# Altium schematic sheet H01R0_Frontend 2.SchDoc
size Letter; CompanyName: Hexabitz; DocumentNumber: 3; SheetNumber: 3; SheetTotal: 3
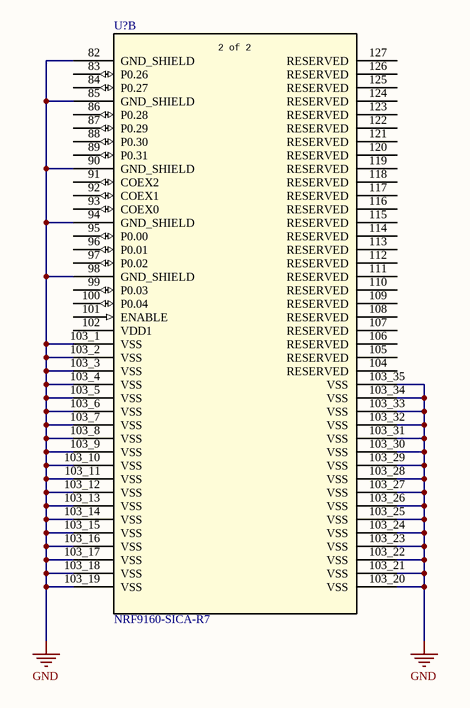
[diagram p0: H01R0_Frontend 2.SchDoc]

## Parts
U?  NRF9160-SICA-R7  [LGA127_16p00X10p50_nRF9160_NOR]  (part B of 2)

## Nets
GND: U?.82(GND_SHIELD) U?.85(GND_SHIELD) U?.90(GND_SHIELD) U?.94(GND_SHIELD) U?.98(GND_SHIELD) U?.103_1(VSS) U?.103_2(VSS) U?.103_3(VSS) U?.103_4(VSS) U?.103_5(VSS) U?.103_6(VSS) U?.103_7(VSS) U?.103_8(VSS) U?.103_9(VSS) U?.103_10(VSS) U?.103_11(VSS) U?.103_12(VSS) U?.103_13(VSS) U?.103_14(VSS) U?.103_15(VSS) U?.103_16(VSS) U?.103_17(VSS) U?.103_18(VSS) U?.103_19(VSS) U?.103_20(VSS) U?.103_21(VSS) U?.103_22(VSS) U?.103_23(VSS) U?.103_24(VSS) U?.103_25(VSS) U?.103_26(VSS) U?.103_27(VSS) U?.103_28(VSS) U?.103_29(VSS) U?.103_30(VSS) U?.103_31(VSS) U?.103_32(VSS) U?.103_33(VSS) U?.103_34(VSS) U?.103_35(VSS)

Not connected (* = marked no-connect by the designer): U? 83(P0.26) 84(P0.27) 86(P0.28) 87(P0.29) 88(P0.30) 89(P0.31) 91(COEX2) 92(COEX1) 93(COEX0) 95(P0.00) 96(P0.01) 97(P0.02) 99(P0.03) 100(P0.04) 101(ENABLE) 102(VDD1) 104(RESERVED) 105(RESERVED) 106(RESERVED) 107(RESERVED) 108(RESERVED) 109(RESERVED) 110(RESERVED) 111(RESERVED) 112(RESERVED) 113(RESERVED) 114(RESERVED) 115(RESERVED) 116(RESERVED) 117(RESERVED) 118(RESERVED) 119(RESERVED) 120(RESERVED) 121(RESERVED) 122(RESERVED) 123(RESERVED) 124(RESERVED) 125(RESERVED) 126(RESERVED) 127(RESERVED)

## Notes on the sheet
- Module:
- Title:
- Description:
- Size:
- Revision:
- Letter
- www.hexabitz.com
- Date:
- Time:
- Sheet
- of
- (in symbol CMP-006-000000-1, part B) 2 of 2

## Library data of the parts
U? = CMP-006-000000-1: Description; Manufacturer_Name: Nordic Semiconductor; Type: RF; Manufacturer_Part_Number: NRF9160-SICA-R7; RefDes: RefDes; Design Item ID: NRF9160-SICA-R7; Source: NRF9160-SICA-R7.SchLib; Copyright: Copyright (C) 2025 Ultra Librarian. All rights reserved.